# Altium schematic sheet motor.SchDoc: Thymio2
size A4; Organization: Original design LSRO-STI-EPFL; Address1: Association Mobsya; Address2: Michael Bonani; Address3: Ch. Closel 3; Address4: CH-1020 Renens; DocumentNumber: 7; Revision: 2.3; SheetNumber: 7; SheetTotal: 9; Engineer: Michael Bonani; Title2: PCB principal; ProjectName: Name of the project
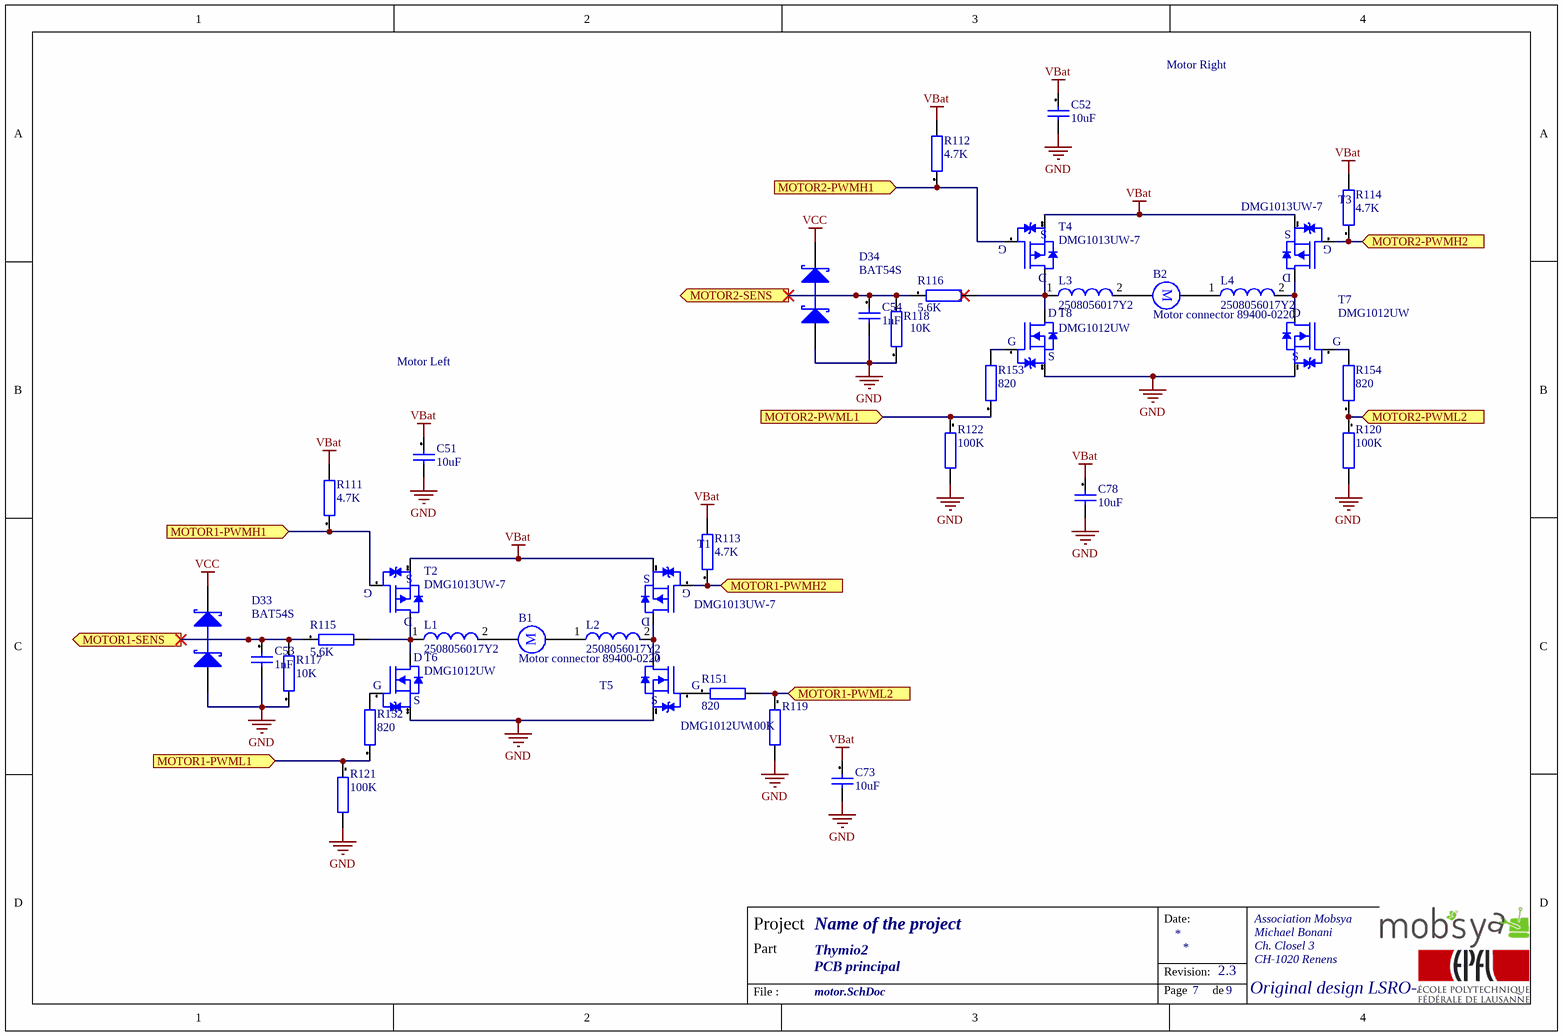
[diagram p0: motor.SchDoc]

## Parts
B1  Motor connector 89400-0220  [BAT-2]
B2  Motor connector 89400-0220  [BAT-2]
C51  10uF  [CAPC1005X05N]
C52  10uF  [CAPC1005X05N]
C53  1nF  [CAPC1005X05N]
C54  1nF  [CAPC1005X05N]
C73  10uF  [CAPC1005X05N]
C78  10uF  [CAPC1005X05N]
D33  BAT54S  [SOT23_N]
D34  BAT54S  [SOT23_N]
L1  2508056017Y2  [INDC2012X11L]
L2  2508056017Y2  [INDC2012X11L]
L3  2508056017Y2  [INDC2012X11L]
L4  2508056017Y2  [INDC2012X11L]
R111  4.7K  [RESC1005X04N]
R112  4.7K  [RESC1005X04N]
R113  4.7K  [RESC1005X04N]
R114  4.7K  [RESC1005X04N]
R115  5.6K  [RESC1005X04N]
R116  5.6K  [RESC1005X04N]
R117  10K  [RESC1005X04N]
R118  10K  [RESC1005X04N]
R119  100K  [RESC1005X04N]
R120  100K  [RESC1005X04N]
R121  100K  [RESC1005X04N]
R122  100K  [RESC1005X04N]
R151  820  [RESC1005X04N]
R152  820  [RESC1005X04N]
R153  820  [RESC1005X04N]
R154  820  [RESC1005X04N]
T1  DMG1013UW-7  [SOT65P210X100-3N]
T2  DMG1013UW-7  [SOT65P210X100-3N]
T3  DMG1013UW-7  [SOT65P210X100-3N]
T4  DMG1013UW-7  [SOT65P210X100-3N]
T5  DMG1012UW  [SOT65P210X100-3N]
T6  DMG1012UW  [SOT65P210X100-3N]
T7  DMG1012UW  [SOT65P210X100-3N]
T8  DMG1012UW  [SOT65P210X100-3N]

## Ports
MOTOR1-PWMH1 (in), MOTOR1-PWMH2 (in), MOTOR1-PWML1 (in), MOTOR1-PWML2 (in), MOTOR1-SENS (out), MOTOR2-PWMH1 (in), MOTOR2-PWMH2 (in), MOTOR2-PWML1 (in), MOTOR2-PWML2 (in), MOTOR2-SENS (out)

## Nets
GND: C51.2 C52.2 C53.2 C54.2 C73.2 C78.2 D33.1(A) D34.1(A) R117.1 R118.1 R119.2 R120.2 R121.2 R122.2 T5.2(S) T6.2(S) T7.2(S) T8.2(S)
VBat: C51.1 C52.1 C73.1 C78.1 R111.2 R112.2 R113.2 R114.2 T1.2(S) T2.2(S) T3.2(S) T4.2(S)
VCC: D33.2(K) D34.2(K)
MOTOR1-PWMH1: R111.1 T2.1(G) ; port MOTOR1-PWMH1
MOTOR1-PWMH2: R113.1 T1.1(G) ; port MOTOR1-PWMH2
MOTOR1-PWML1: R121.1 R152.1 ; port MOTOR1-PWML1
MOTOR1-PWML2: R119.1 R151.2 ; port MOTOR1-PWML2
MOTOR1-SENS: C53.1 D33.3(C) R115.1 R117.2 ; port MOTOR1-SENS
MOTOR2-PWMH1: R112.1 T4.1(G) ; port MOTOR2-PWMH1
MOTOR2-PWMH2: R114.1 T3.1(G) ; port MOTOR2-PWMH2
MOTOR2-PWML1: R122.1 R153.1 ; port MOTOR2-PWML1
MOTOR2-PWML2: R120.1 R154.1 ; port MOTOR2-PWML2
MOTOR2-SENS: C54.1 D34.3(C) R116.1 R118.2 ; port MOTOR2-SENS
NetB1_1: B1.1 L1.2
NetB1_2: B1.2 L2.1
NetB2_1: B2.1 L4.1
NetB2_2: B2.2 L3.2
NetL1_1: L1.1 R115.2 T2.3(D) T6.3(D)
NetL2_2: L2.2 T1.3(D) T5.3(D)
NetL3_1: L3.1 R116.2 T4.3(D) T8.3(D)
NetL4_2: L4.2 T3.3(D) T7.3(D)
NetR151_1: R151.1 T5.1(G)
NetR152_2: R152.2 T6.1(G)
NetR153_2: R153.2 T8.1(G)
NetR154_2: R154.2 T7.1(G)

## Notes on the sheet
- Motor Right
- Motor Left
- Date:
- Project
- Part
- Revision:
- File :
- Page
- de
- (in symbol Motor) M

## Library data of the parts
B1 B2 = Motor: Motor, General Kind; LayerSch: Top; Published: 24-Mar-1999; LatestRevisionDate: 17-Jul-2002; LatestRevisionNote: Re-released for DXP Platform.; PackageReference: RB5-10.5; Publisher: Altium Limited
C51 C52 C73 C78 = 10uF[[/\]]0603[[/\]]1: Capacitor; Manufacturer: Taiyo Yuden; Manufacturer Nr: JMK107BJ106MA-T; Preference: 1; Tolerance +: +15; Tolerance -: -15; Dielectric: X5R; Voltage: 6.3; MaxTemperature: +85; MinTemperature: -55; Quant_2: 100; Quant_3: 500; Currentie: CHF; Size: 0603; Footprint Acort: 0603_G; Supplier: Farnell; Supplier Nr: 1463375; ComponentLink2Description: Farnell link; ComponentLink2URL: http://ch.farnell.com/jsp/displayProduct.jsp?sku=1463375; Quant_1: 1; Price_1: 0.768; Price_2: 0.674; Price_3: 0.372; ROHS: True; DateLastUpdate: 2007-12-03 / 14:22:36
C53 C54 = 100nF[[/\]]0603[[/\]]1: Capacitor; Manufacturer: Kemet; Manufacturer Nr: C0603C104K5RAC; Preference: 1; Tolerance +: +10; Tolerance -: -10; Dielectric: X7R; Voltage: 50; MaxTemperature: +125; MinTemperature: -55; Quant_1: 10; Quant_2: 100; Quant_3: 1000; Quant_4: 4000; Currentie: CHF; LayerSch: Top; Size: 0603; Footprint Acort: 0603_G; Supplier: Farnell; Supplier Nr: 1288255; ComponentLink2Description: Farnell link; ComponentLink2URL: http://ch.farnell.com/jsp/displayProduct.jsp?sku=1288255; Price_1: 0.046; Price_2: 0.04; Price_3: 0.037; Price_4: 0.036; ROHS: True; DateLastUpdate: 2007-12-03 / 14:22:31
D33 D34 = BAT54S: Schottky Barrier Double Diode; LayerSch: Top; Published: 17-Sep-2003; LatestRevisionDate: 12-Dec-2006; LatestRevisionNote: IPC-7351 Footprint Added.; DatasheetVersion: 4-Mar-2002; PackageVersion: May-1999; PackageReference: SOT23; Publisher: Altium Limited; PackageDescription: 3-Pin SOT-23 Package 0.95 mm Pitch, 2.3 mm Lead Span; ComponentLink1Description: Manufacturer Link; ComponentLink1URL: http://www.semiconductors.philips.com/; ComponentLink2Description: Datasheet; ComponentLink2URL: http://www.semiconductors.philips.com/acrobat/datasheets/BAT54_SERIES_4.pdf
L1-L4 = 74279204: SMD EMI Suppression Ferrite Bead WE-CBF, Z = 600 Ohm; Impedance: 600 Ohm; PackageReference: SMD-0805; PackageDescription: Chip Inductor, 2-Leads, Body 2.0 x 1.2 mm; PartNumber: 2508056017Y2; ComponentLink1Description: Fair-Rite; ComponentLink2Description: https://www.mouser.ch/datasheet/2/150/2508056017Y2-472219.pdf
R111-R114 = 4.7K[[/\]]0603[[/\]]1: Resistor; Manufacturer: Vishay; Manufacturer Nr: D11CRCW06030B4701F; Tolerance: +/-1; Preference: 1; Power: 0.1; Voltage: 75; Current: 1.5; ppm/K: +/-100; Quant_1: 10; Quant_2: 100; Quant_3: 500; Currentie: CHF; Size: 0603; Footprint Acort: 0603; Supplier: Distrelec; Supplier Nr: 715604; ComponentLink2Description: Distrelec link; ComponentLink2URL: http://www.distrelec.com/ishopWebFront/search/luceneSearch.do?dispatch=find&showImage=on&artnrPhrase=715604; ROHS: True; Price_1: 0.0538; Price_2: 0.0323; Price_3: 0.0204; DateLastUpdate: 2007-12-03 / 16:30:20
R115 R116 = 2.2K[[/\]]0603[[/\]]1: Resistor; Manufacturer: Vishay; Manufacturer Nr: D11CRCW06030B2201F; Tolerance: +/-1; Preference: 1; Power: 0.1; Voltage: 75; Current: 1.5; ppm/K: +/-100; Quant_1: 10; Quant_2: 100; Quant_3: 500; Currentie: CHF; LayerSch: Top; Size: 0603; Footprint Acort: 0603; Supplier: Distrelec; Supplier Nr: 715596; ComponentLink2Description: Distrelec link; ComponentLink2URL: http://www.distrelec.com/ishopWebFront/search/luceneSearch.do?dispatch=find&showImage=on&artnrPhrase=715596; ROHS: True; Price_1: 0.085; Price_2: 0.0603; Price_3: 0.0247; DateLastUpdate: 2009-06-10 / 12:36:43
R117 R118 = 8.2K[[/\]]0603[[/\]]2: Resistor; Manufacturer: Multicomp; Manufacturer Nr: MC 0.063W 0603 1% 8K2; Tolerance: +/-1%; Preference: 2; Power: 0.063; Voltage: 50; Current: 1; ppm/K: +/-100; Quant_2: 250; Quant_3: 1000; Quant_4: 5000; Quant_5: 15000; Currentie: CHF; LayerSch: Top; Size: 0603; Footprint Acort: 0603; Supplier: Farnell; Supplier Nr: 9331565; ComponentLink2Description: Farnell link; ComponentLink2URL: http://ch.farnell.com/jsp/displayProduct.jsp?sku=9331565; ROHS: True; Quant_1: 50; Price_1: 0.062; Price_2: 0.049; Price_3: 0.038; Price_4: 0.027; Price_5: 0.021; DateLastUpdate: 2007-11-29 / 09:13:37
R119-R122 = 100K[[/\]]0603[[/\]]1: Resistor; Manufacturer: Vishay; Manufacturer Nr: D11CRCW06030B1003F; Tolerance: +/-1; Preference: 1; Power: 0.1; Voltage: 75; Current: 1.5; ppm/K: +/-100; Quant_1: 10; Quant_2: 100; Quant_3: 500; Currentie: CHF; Size: 0603; Footprint Acort: 0603; ComponentLink1Description: OnLine datasheet; Supplier: Distrelec; Supplier Nr: 715636; ComponentLink2Description: Distrelec link; ComponentLink2URL: http://www.distrelec.com/ishopWebFront/search/luceneSearch.do?dispatch=find&showImage=on&artnrPhrase=715636; ROHS: True; Price_1: 0.0538; Price_2: 0.0323; Price_3: 0.0204; DateLastUpdate: 2007-12-03 / 16:29:58
R151-R154 = 22K[[/\]]0603[[/\]]1: Resistor; Manufacturer: Vishay; Manufacturer Nr: D11CRCW06030B2202F; Tolerance: +/-1; Preference: 1; Power: 0.1; Voltage: 75; Current: 1.5; ppm/K: +/-100; Quant_1: 10; Quant_2: 100; Quant_3: 500; Currentie: CHF; LayerSch: Top; Size: 0603; Footprint Acort: 0603; Supplier: Distrelec; Supplier Nr: 715620; ComponentLink2Description: Distrelec link; ComponentLink2URL: http://www.distrelec.com/ishopWebFront/search/luceneSearch.do?dispatch=find&showImage=on&artnrPhrase=715620; ROHS: True; Price_1: 0.0538; Price_2: 0.0323; Price_3: 0.0204; DateLastUpdate: 2007-12-03 / 16:30:04
T1-T4 = DMG1013T: Transistor MOSFET 1 x P Pining : 1=G, 2=S, 3=D; VerifiedComment: Ok; VerifiedBy: DBR; VerifiedDate: 20071013
T5-T8 = DMG1012T: Transistor MOSFET 1 x N, Pining : 1=G, 2=S, 3=D; VerifiedComment: Ok; VerifiedBy: DBR; VerifiedDate: 20071013